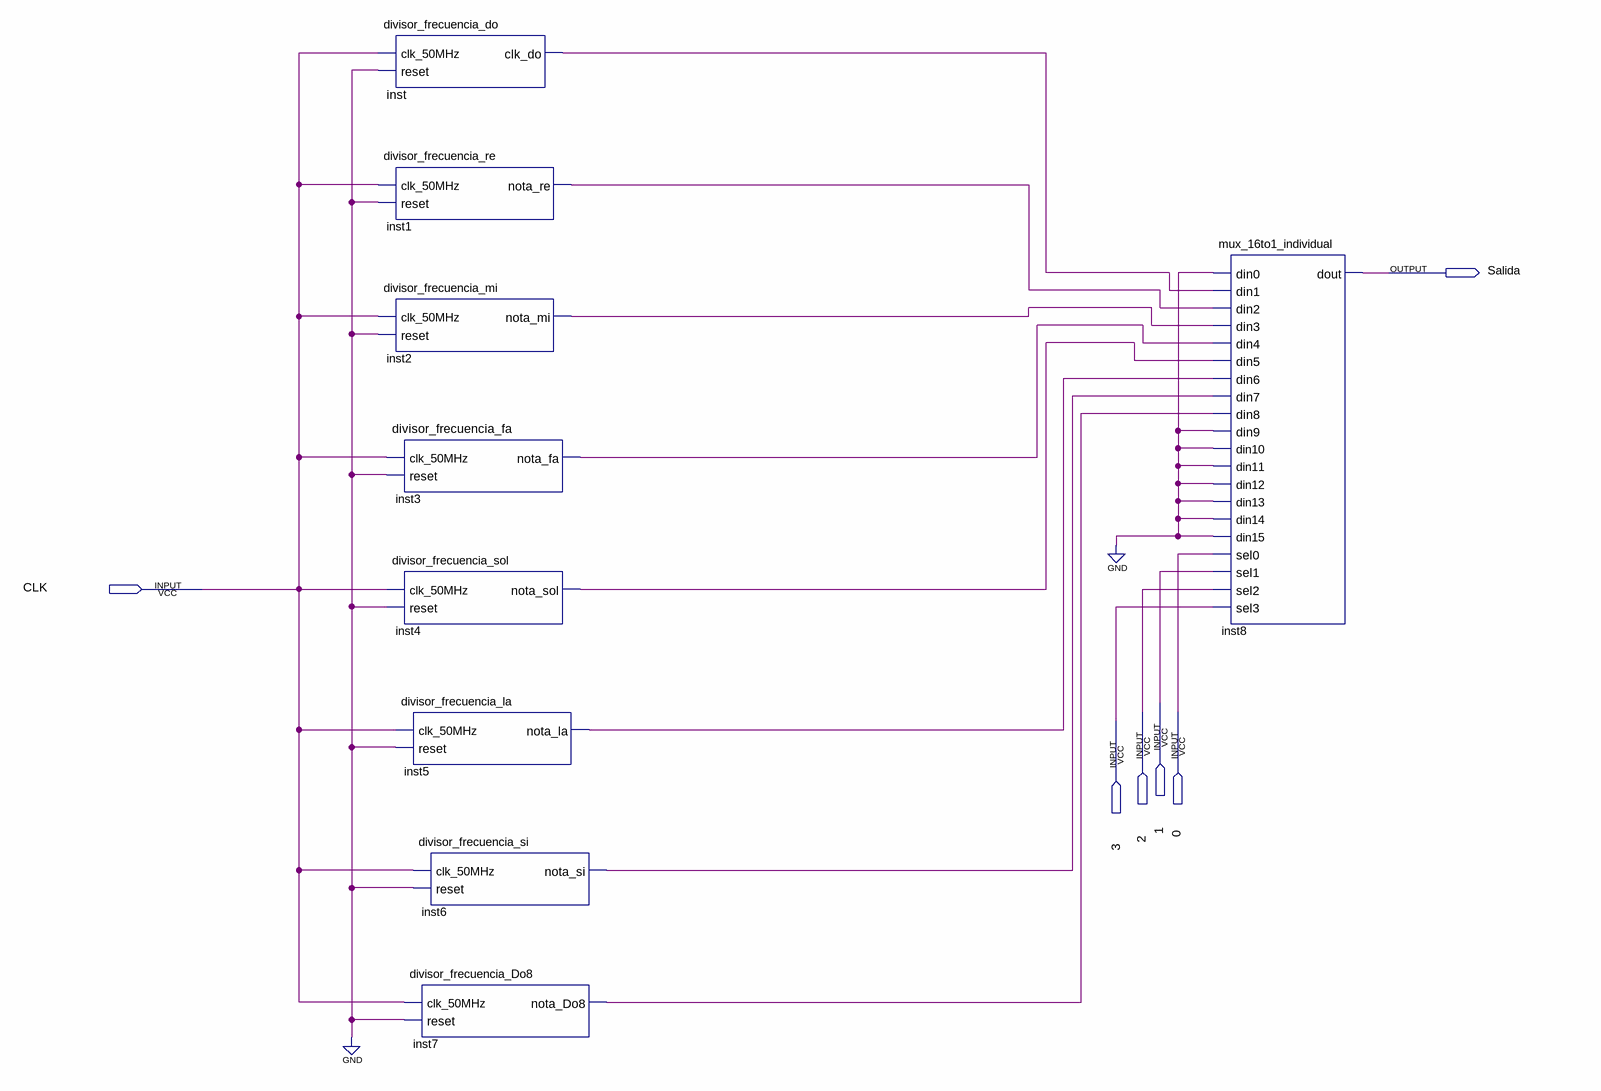
[diagram p0: schematic sheet]
// Quartus schematic cristianpiano.bdf as structural Verilog: 9 symbols, 6 pins
module cristianpiano (
  input  CLK,
  input  \1 ,
  input  \2 ,
  input  \0 ,
  input  \3 ,
  output Salida
);

  wire inst1_nota_re, inst2_nota_mi, inst3_nota_fa, inst4_nota_sol, inst5_nota_la, inst6_nota_si,
       inst7_nota_do8, inst_clk_do;

  divisor_frecuencia_do inst (.clk_50MHz(CLK), .reset(1'b0), .clk_do(inst_clk_do));
  divisor_frecuencia_re inst1 (.clk_50MHz(CLK), .reset(1'b0), .nota_re(inst1_nota_re));
  divisor_frecuencia_mi inst2 (.clk_50MHz(CLK), .reset(1'b0), .nota_mi(inst2_nota_mi));
  divisor_frecuencia_fa inst3 (.clk_50MHz(CLK), .reset(1'b0), .nota_fa(inst3_nota_fa));
  divisor_frecuencia_sol inst4 (.clk_50MHz(CLK), .reset(1'b0), .nota_sol(inst4_nota_sol));
  divisor_frecuencia_la inst5 (.clk_50MHz(CLK), .reset(1'b0), .nota_la(inst5_nota_la));
  divisor_frecuencia_si inst6 (.clk_50MHz(CLK), .reset(1'b0), .nota_si(inst6_nota_si));
  divisor_frecuencia_Do8 inst7 (.clk_50MHz(CLK), .reset(1'b0), .nota_Do8(inst7_nota_do8));
  mux_16to1_individual inst8 (
    .din0(1'b0), .din1(inst_clk_do), .din2(inst1_nota_re), .din3(inst2_nota_mi), .din4(inst3_nota_fa),
    .din5(inst4_nota_sol), .din6(inst5_nota_la), .din7(inst6_nota_si), .din8(inst7_nota_do8), .din9(1'b0),
    .din10(1'b0), .din11(1'b0), .din12(1'b0), .din13(1'b0), .din14(1'b0), .din15(1'b0), .sel0(\0 ),
    .sel1(\1 ), .sel2(\2 ), .sel3(\3 ), .dout(Salida));
endmodule
